# EasyEDA Pro project RFID Arduino REV04.eprj

# Schematic RFID Arduino REV04
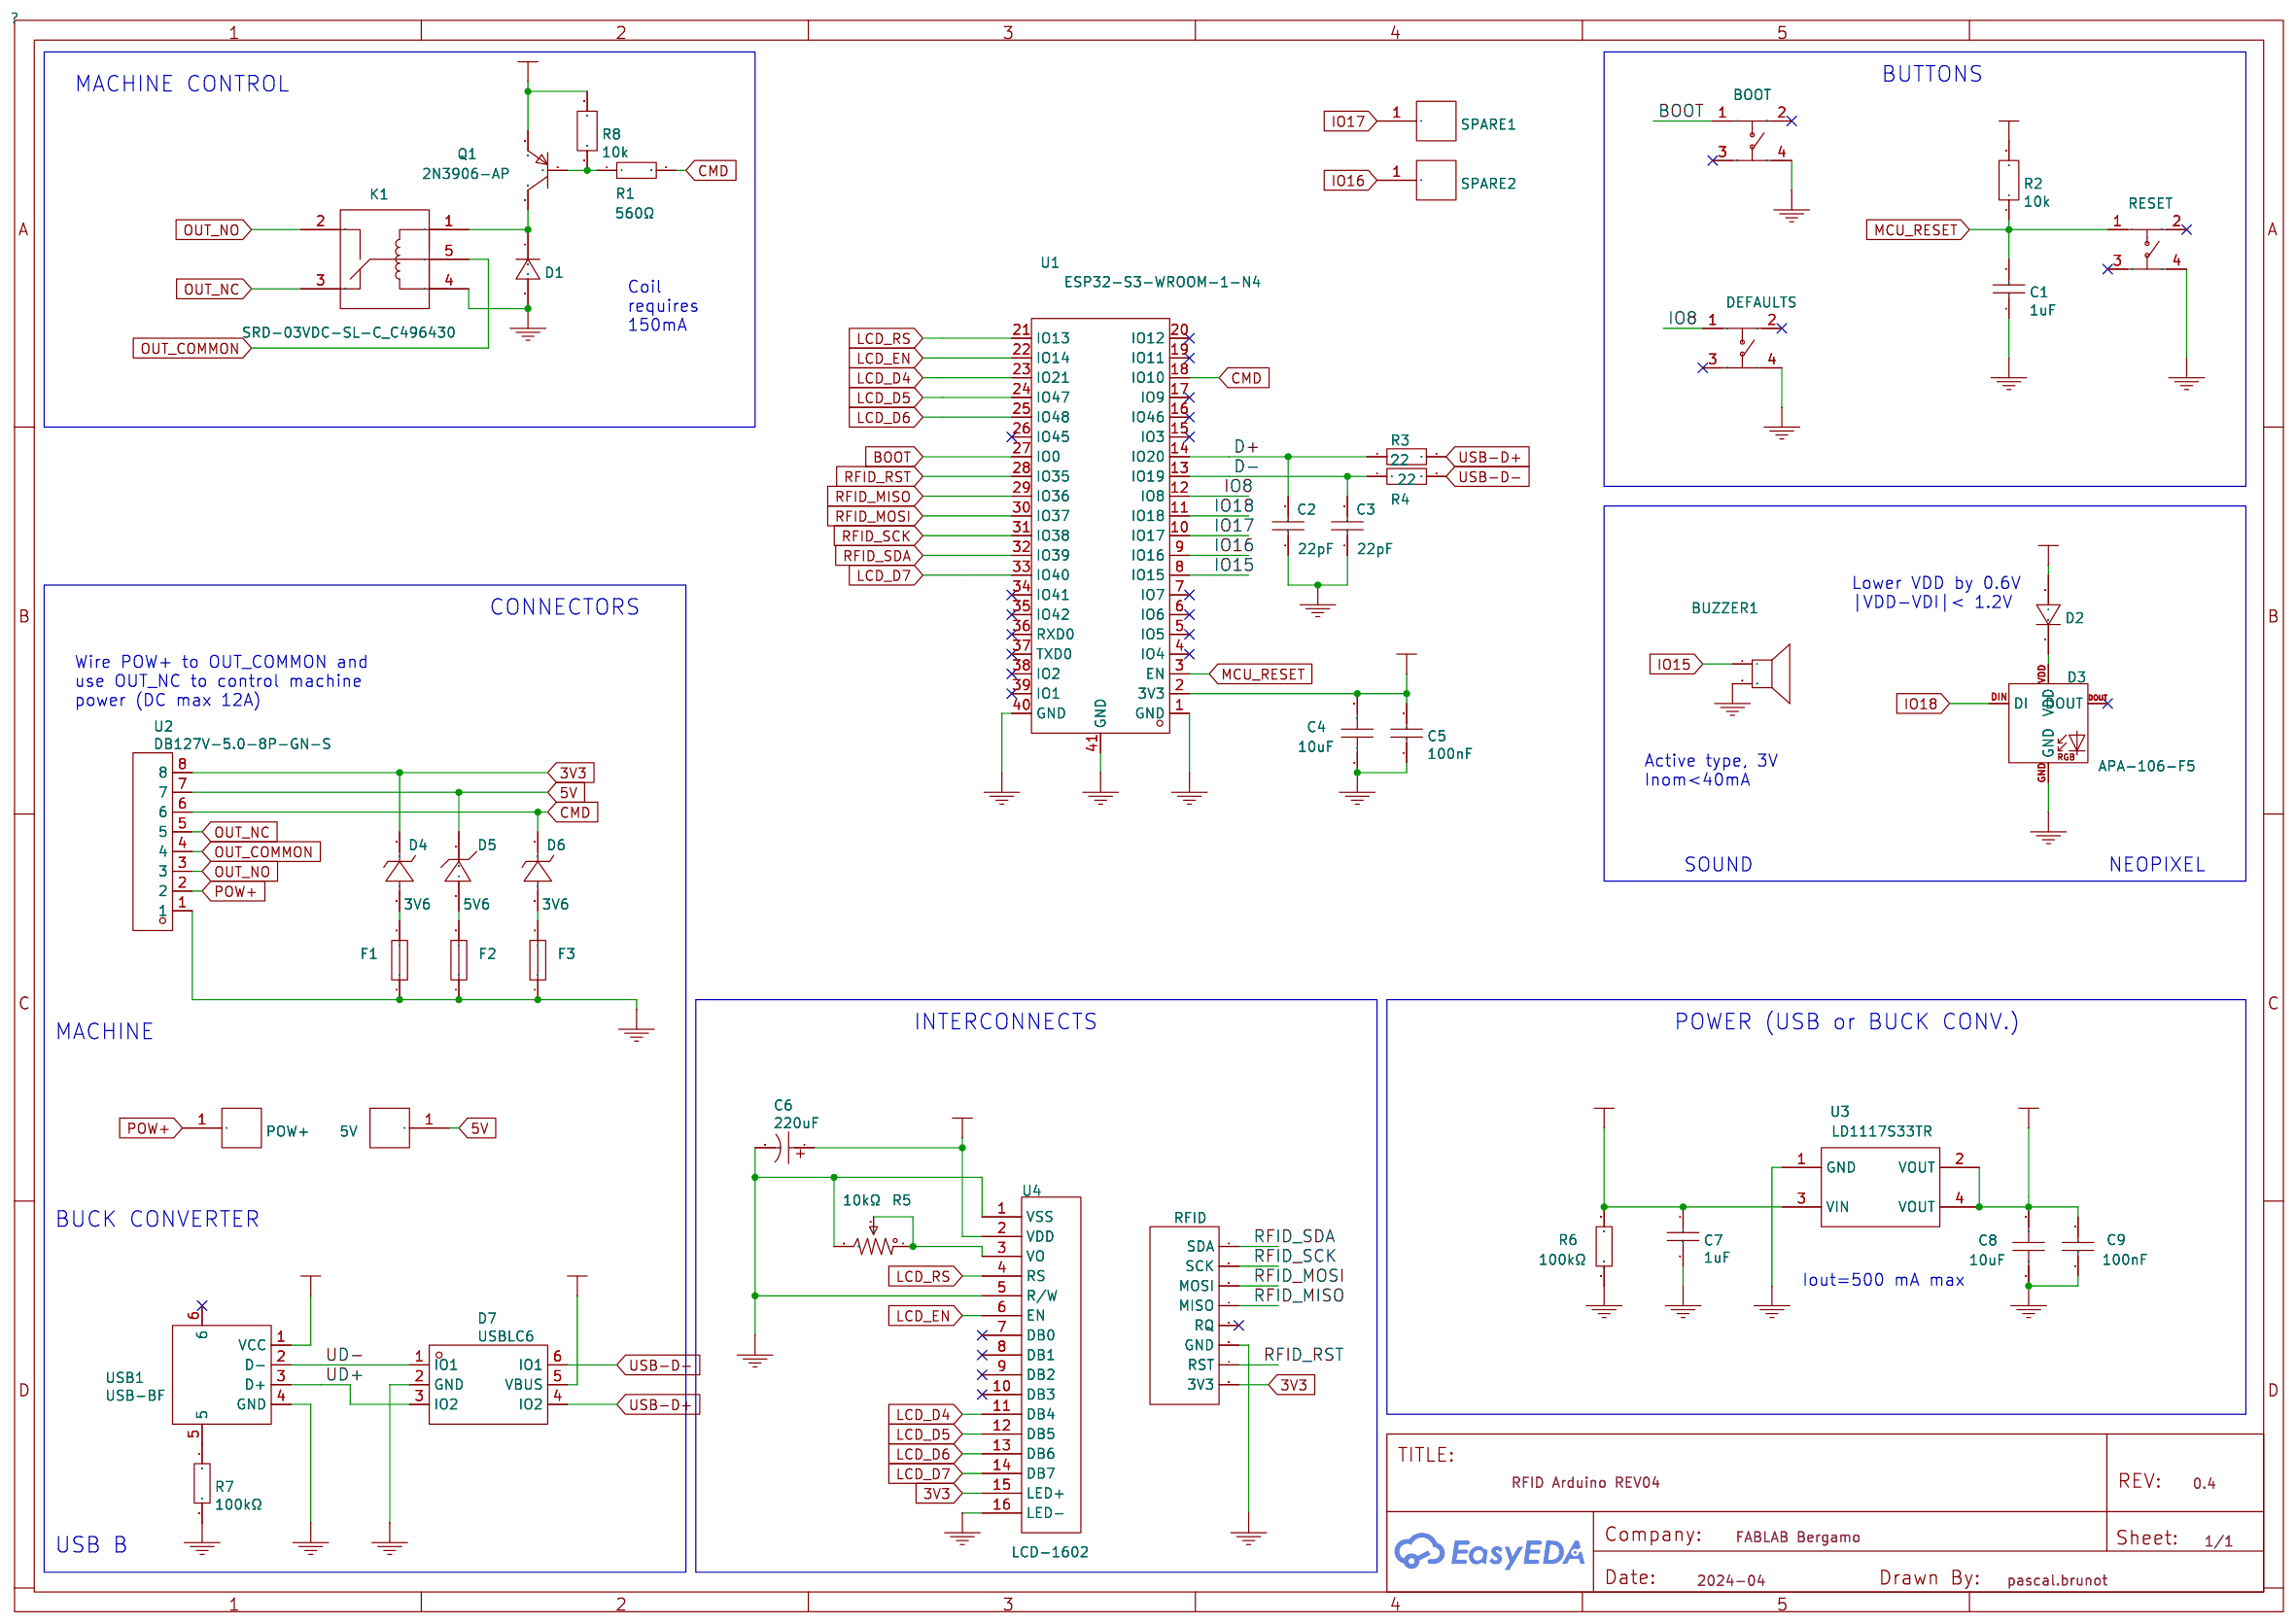
[diagram p0: schematic sheet]

## Parts
5V  0577-0-43-80-21-27-10-0  [footprint_186c]  (no BOM)
BOOT  TS02-66-160-BK-260-LCR-D  [footprint_d5ca]
BUZZER1  4000Hz  [footprint_4700]
C1  1uF  [footprint_c612]
C2  22pF  [footprint_7342]
C3  22pF  [footprint_5873]
C4  10uF  [footprint_c612]
C5  100nF  [footprint_c612]
C6  220uF  [footprint_9de2]
C7  1uF  [footprint_c612]
C8  10uF  [footprint_c612]
C9  100nF  [footprint_c612]
D1  SM4007PL  [footprint_98a7]
D2  SM4007PL  [footprint_98a7]
D3  APA-106-F5  [footprint_7df5]  (no BOM)
D4  3V6  [footprint_9df2]
D5  5V6  [footprint_7d78]
D6  3V6  [footprint_9df2]
D7  USBLC6  [footprint_c63f]
DEFAULTS  TS02-66-160-BK-260-LCR-D  [footprint_01f8]
F1  1206L016WR  [footprint_80a4]
F2  1206L016WR  [footprint_80a4]
F3  1206L016WR  [footprint_80a4]
K1  SRD-03VDC-SL-C_C496430  [footprint_073f]  (no BOM)
P1  RFID  [footprint_407f]
POW+  0577-0-43-80-21-27-10-0  [footprint_186c]  (no BOM)
Q1  2N3906-AP  [footprint_6217]
R1  560Ω  [footprint_ec5b]
R2  10k  [footprint_7623]
R3  22  [footprint_7623]
R4  22  [footprint_7623]
R5  10kΩ  [footprint_ac57]
R6  100kΩ  [footprint_ec5b]
R7  100kΩ  [footprint_ec5b]
R8  10k  [footprint_7623]
RESET  TS02-66-160-BK-260-LCR-D  [footprint_d5ca]
SPARE1  0577-0-43-80-21-27-10-0  [footprint_186c]  (no BOM)
SPARE2  0577-0-43-80-21-27-10-0  [footprint_186c]  (no BOM)
U1  ESP32-S3-WROOM-1-N4  [footprint_15fb]
U2  DB127V-5.0-8P-GN-S  [footprint_3f91]
U3  LD1117S33TR  [footprint_bf77]
U4  LCD-1602  [footprint_ddb7]
USB1  USB-BF  [footprint_8114]

## Library data of the parts
5V POW+ SPARE1 SPARE2 = 0577-0-43-80-21-27-10-0: Supplier: LCSC; Supplier Part: C2895400; Manufacturer: null; JLCPCB Part Class: Extended Part
BOOT DEFAULTS RESET = TS02-66-160-BK-260-LCR-D: Supplier: LCSC; Supplier Part: C4364276; Manufacturer: CUI; JLCPCB Part Class: Extended Part
BUZZER1 = 4000Hz: Supplier: LCSC; Supplier Part: C360607; Manufacturer: S&amp;S(海旭); Manufacturer Part: SFN-12055PA6.5; JLCPCB Part Class: Extended Part
C1 C7 = 1uF: Supplier: LCSC; Manufacturer Part: CL21B105KBFNNNE; Manufacturer: SAMSUNG(三星); Supplier Part: C28323; JLCPCB Part Class: Basic Part
C2 C3 = 22pF: Supplier: LCSC; Manufacturer: FH(风华); Manufacturer Part: 0402CG220J500NT; Supplier Part: C1555; JLCPCB Part Class: Basic Part
C4 C8 = 10uF: Supplier: LCSC; Supplier Part: C440198; Manufacturer: muRata(村田); Manufacturer Part: GRM21BR61H106KE43L; JLCPCB Part Class: Basic Part
C5 C9 = 100nF: Supplier: LCSC; Manufacturer Part: CL21B104KCFNNNE; Manufacturer: SAMSUNG(三星); Supplier Part: C28233; JLCPCB Part Class: Basic Part
C6 = 220uF: Supplier: LCSC; Manufacturer: null; Manufacturer Part: 220uF 10V 5*7; Supplier Part: C43320; JLCPCB Part Class: Extended Part
D1 D2 = SM4007PL: Supplier: LCSC; Manufacturer: MDD; Supplier Part: C64898; JLCPCB Part Class: Basic Part
D3 = APA-106-F5
D4 D6 = 3V6: Supplier: LCSC; Supplier Part: C713621; Manufacturer: LGE(鲁光); Manufacturer Part: 1SMA5914A; JLCPCB Part Class: Extended Part
D5 = 5V6: Supplier: LCSC; Manufacturer Part: ZMM5V6-M; Manufacturer: ST(先科); Supplier Part: C8062; JLCPCB Part Class: Extended Part
D7 = USBLC6: Supplier: LCSC; Supplier Part: C2827654; Manufacturer: TECH PUBLIC(台舟); Manufacturer Part: USBLC6-2SC6; JLCPCB Part Class: Extended Part
F1-F3 = 1206L016WR: Supplier: LCSC; Supplier Part: C151161; Manufacturer: Littelfuse(美国力特); JLCPCB Part Class: Extended Part
K1 = SRD-03VDC-SL-C_C496430: Supplier: LCSC; Supplier Part: C496430; Manufacturer: 松乐; Manufacturer Part: SRD-03VDC-SL-C; JLCPCB Part Class: Extended Part
P1 = RFID: Supplier Part: C27438; Supplier: LCSC; Manufacturer: BOOMELE; Manufacturer Part: Female headerHDR1X8-2.54
Q1 = 2N3906-AP: Supplier: LCSC; Supplier Part: C2987037; Manufacturer: MCC(美微科); JLCPCB Part Class: Extended Part
R1 = 560Ω: Supplier: LCSC; Manufacturer: UNI-ROYAL(厚声); Manufacturer Part: 0805W8F5600T5E; Supplier Part: C28636; JLCPCB Part Class: Basic Part
R2 R8 = 10k: Supplier Part: C17414; Supplier: LCSC; Manufacturer Part: 0805W8F1002T5E; Manufacturer: UNI-ROYAL(厚声)
R3 R4 = 22: Supplier: LCSC; Manufacturer: UNI-ROYAL(厚声); Manufacturer Part: 0603WAF220JT5E; Supplier Part: C23345; JLCPCB Part Class: Basic Part
R5 = 10kΩ: Resistance: 10K; Supplier: LCSC; Supplier Part: C118954; Manufacturer: BOCHEN(博晨); Manufacturer Part: 3296W-1-103; JLCPCB Part Class: Extended Part
R6 R7 = 100kΩ: Supplier: LCSC; Supplier Part: C149504; Manufacturer: UNI-ROYAL(厚声); Manufacturer Part: 0805W8F1003T5E; JLCPCB Part Class: Basic Part
U1 = ESP32-S3-WROOM-1-N4: Supplier: LCSC; Supplier Part: C2913197; Manufacturer: ESPRESSIF(乐鑫); JLCPCB Part Class: Extended Part
U2 = DB127V-5.0-8P-GN-S: Supplier: LCSC; Supplier Part: C430626; Manufacturer: DORABO(地博电气); JLCPCB Part Class: Extended Part
U3 = LD1117S33TR: Supplier: LCSC; Supplier Part: C86781; Manufacturer: ST(意法半导体); JLCPCB Part Class: Extended Part
U4 = LCD-1602: Manufacturer Part: ?
USB1 = USB-BF: Supplier: LCSC; Supplier Part: C114097; Manufacturer: MOLEX; Manufacturer Part: 670688000; JLCPCB Part Class: Extended Part

## Nets
3V3: C4.2 C5.2 C8.2 C9.2 D4.1(C) P1.8(3V3) Q1.1 R2.2 R8.2 U1.2(3V3) U2.8 U3.2(VOUT) U3.4(VOUT) U4.15(LED+)
5V: 5V.1 C6.1 C7.1 D2.2(A) D5.1(C) D7.5(VBUS) R6.2 U2.7 U3.3(VIN) U4.2(VDD) USB1.1(VCC)
GND: BOOT.4 BUZZER1.2 C1.1 C2.1 C3.1 C4.1 C5.1 C6.2 C7.2 C8.1 C9.1 D1.2(A) D3.GND D7.2(GND) DEFAULTS.4 F1.1 F2.1 F3.1 K1.4 P1.6(GND) R5.3 R6.1 R7.2 RESET.4 U1.1(GND) U1.40(GND) U1.41(GND) U2.1 U3.1(GND) U4.1(VSS) U4.5(R/W) U4.16(LED-) USB1.4(GND)
BOOT: BOOT.1 U1.27(IO0)
CMD: D6.1(C) R1.2 U1.18(IO10) U2.6
D+: C2.2 R3.1 U1.14(IO20)
D-: C3.2 R4.1 U1.13(IO19)
IO8: DEFAULTS.1 U1.12(IO8)
IO15: BUZZER1.1 U1.8(IO15)
IO16: SPARE2.1 U1.9(IO16)
IO17: SPARE1.1 U1.10(IO17)
IO18: D3.DIN(DI) U1.11(IO18)
LCD_D4: U1.23(IO21) U4.11(DB4)
LCD_D5: U1.24(IO47) U4.12(DB5)
LCD_D6: U1.25(IO48) U4.13(DB6)
LCD_D7: U1.33(IO40) U4.14(DB7)
LCD_EN: U1.22(IO14) U4.6(EN)
LCD_RS: U1.21(IO13) U4.4(RS)
MCU_RESET: C1.2 R2.1 RESET.1 U1.3(EN)
OUT_COMMON: K1.5 U2.4
OUT_NC: K1.3 U2.5
OUT_NO: K1.2 U2.3
POW+: POW+.1 U2.2
RFID_MISO: P1.4(MISO) U1.29(IO36)
RFID_MOSI: P1.3(MOSI) U1.30(IO37)
RFID_RST: P1.7(RST) U1.28(IO35)
RFID_SCK: P1.2(SCK) U1.31(IO38)
RFID_SDA: P1.1(SDA) U1.32(IO39)
UD+: D7.3(IO2) USB1.3(D+)
UD-: D7.1(IO1) USB1.2(D-)
USB-D+: D7.4(IO2) R3.2
USB-D-: D7.6(IO1) R4.2
$1N49: R5.1 R5.2 U4.3(VO)
$1N85: D1.1(C) K1.1 Q1.3
$1N86: Q1.2 R1.1 R8.1
$1N90: D2.1(C) D3.VDD
$1N92: D6.2(A) F3.2
$1N93: D4.2(A) F1.2
$1N95: D5.2(A) F2.2
$1N1128: R7.1 USB1.5

Not connected (* = marked no-connect by the designer): BOOT 2* 3*; D3 DOUT*; DEFAULTS 2* 3*; P1 5(RQ)*; RESET 2* 3*; U1 4(IO4)* 5(IO5)* 6(IO6)* 7(IO7)* 15(IO3)* 16(IO46)* 17(IO9)* 19(IO11)* 20(IO12)* 26(IO45)* 34(IO41)* 35(IO42)* 36(RXD0)* 37(TXD0)* 38(IO2)* 39(IO1)*; U4 7(DB0)* 8(DB1)* 9(DB2)* 10(DB3)*; USB1 6*

## Notes on the sheet
- MACHINE CONTROL
- BUTTONS
- Coil
  requires
  150mA
- Lower VDD by 0.6V
  |VDD-VDI|< 1.2V
- CONNECTORS
- Wire POW+ to OUT_COMMON and
  use OUT_NC to control machine
  power (DC max 12A)
- Active type, 3V
  Inom<40mA
- SOUND
- NEOPIXEL
- INTERCONNECTS
- POWER (USB or BUCK CONV.)
- MACHINE
- BUCK CONVERTER
- Iout=500 mA max
- USB B

# Board 1-PCB_PCB REV04
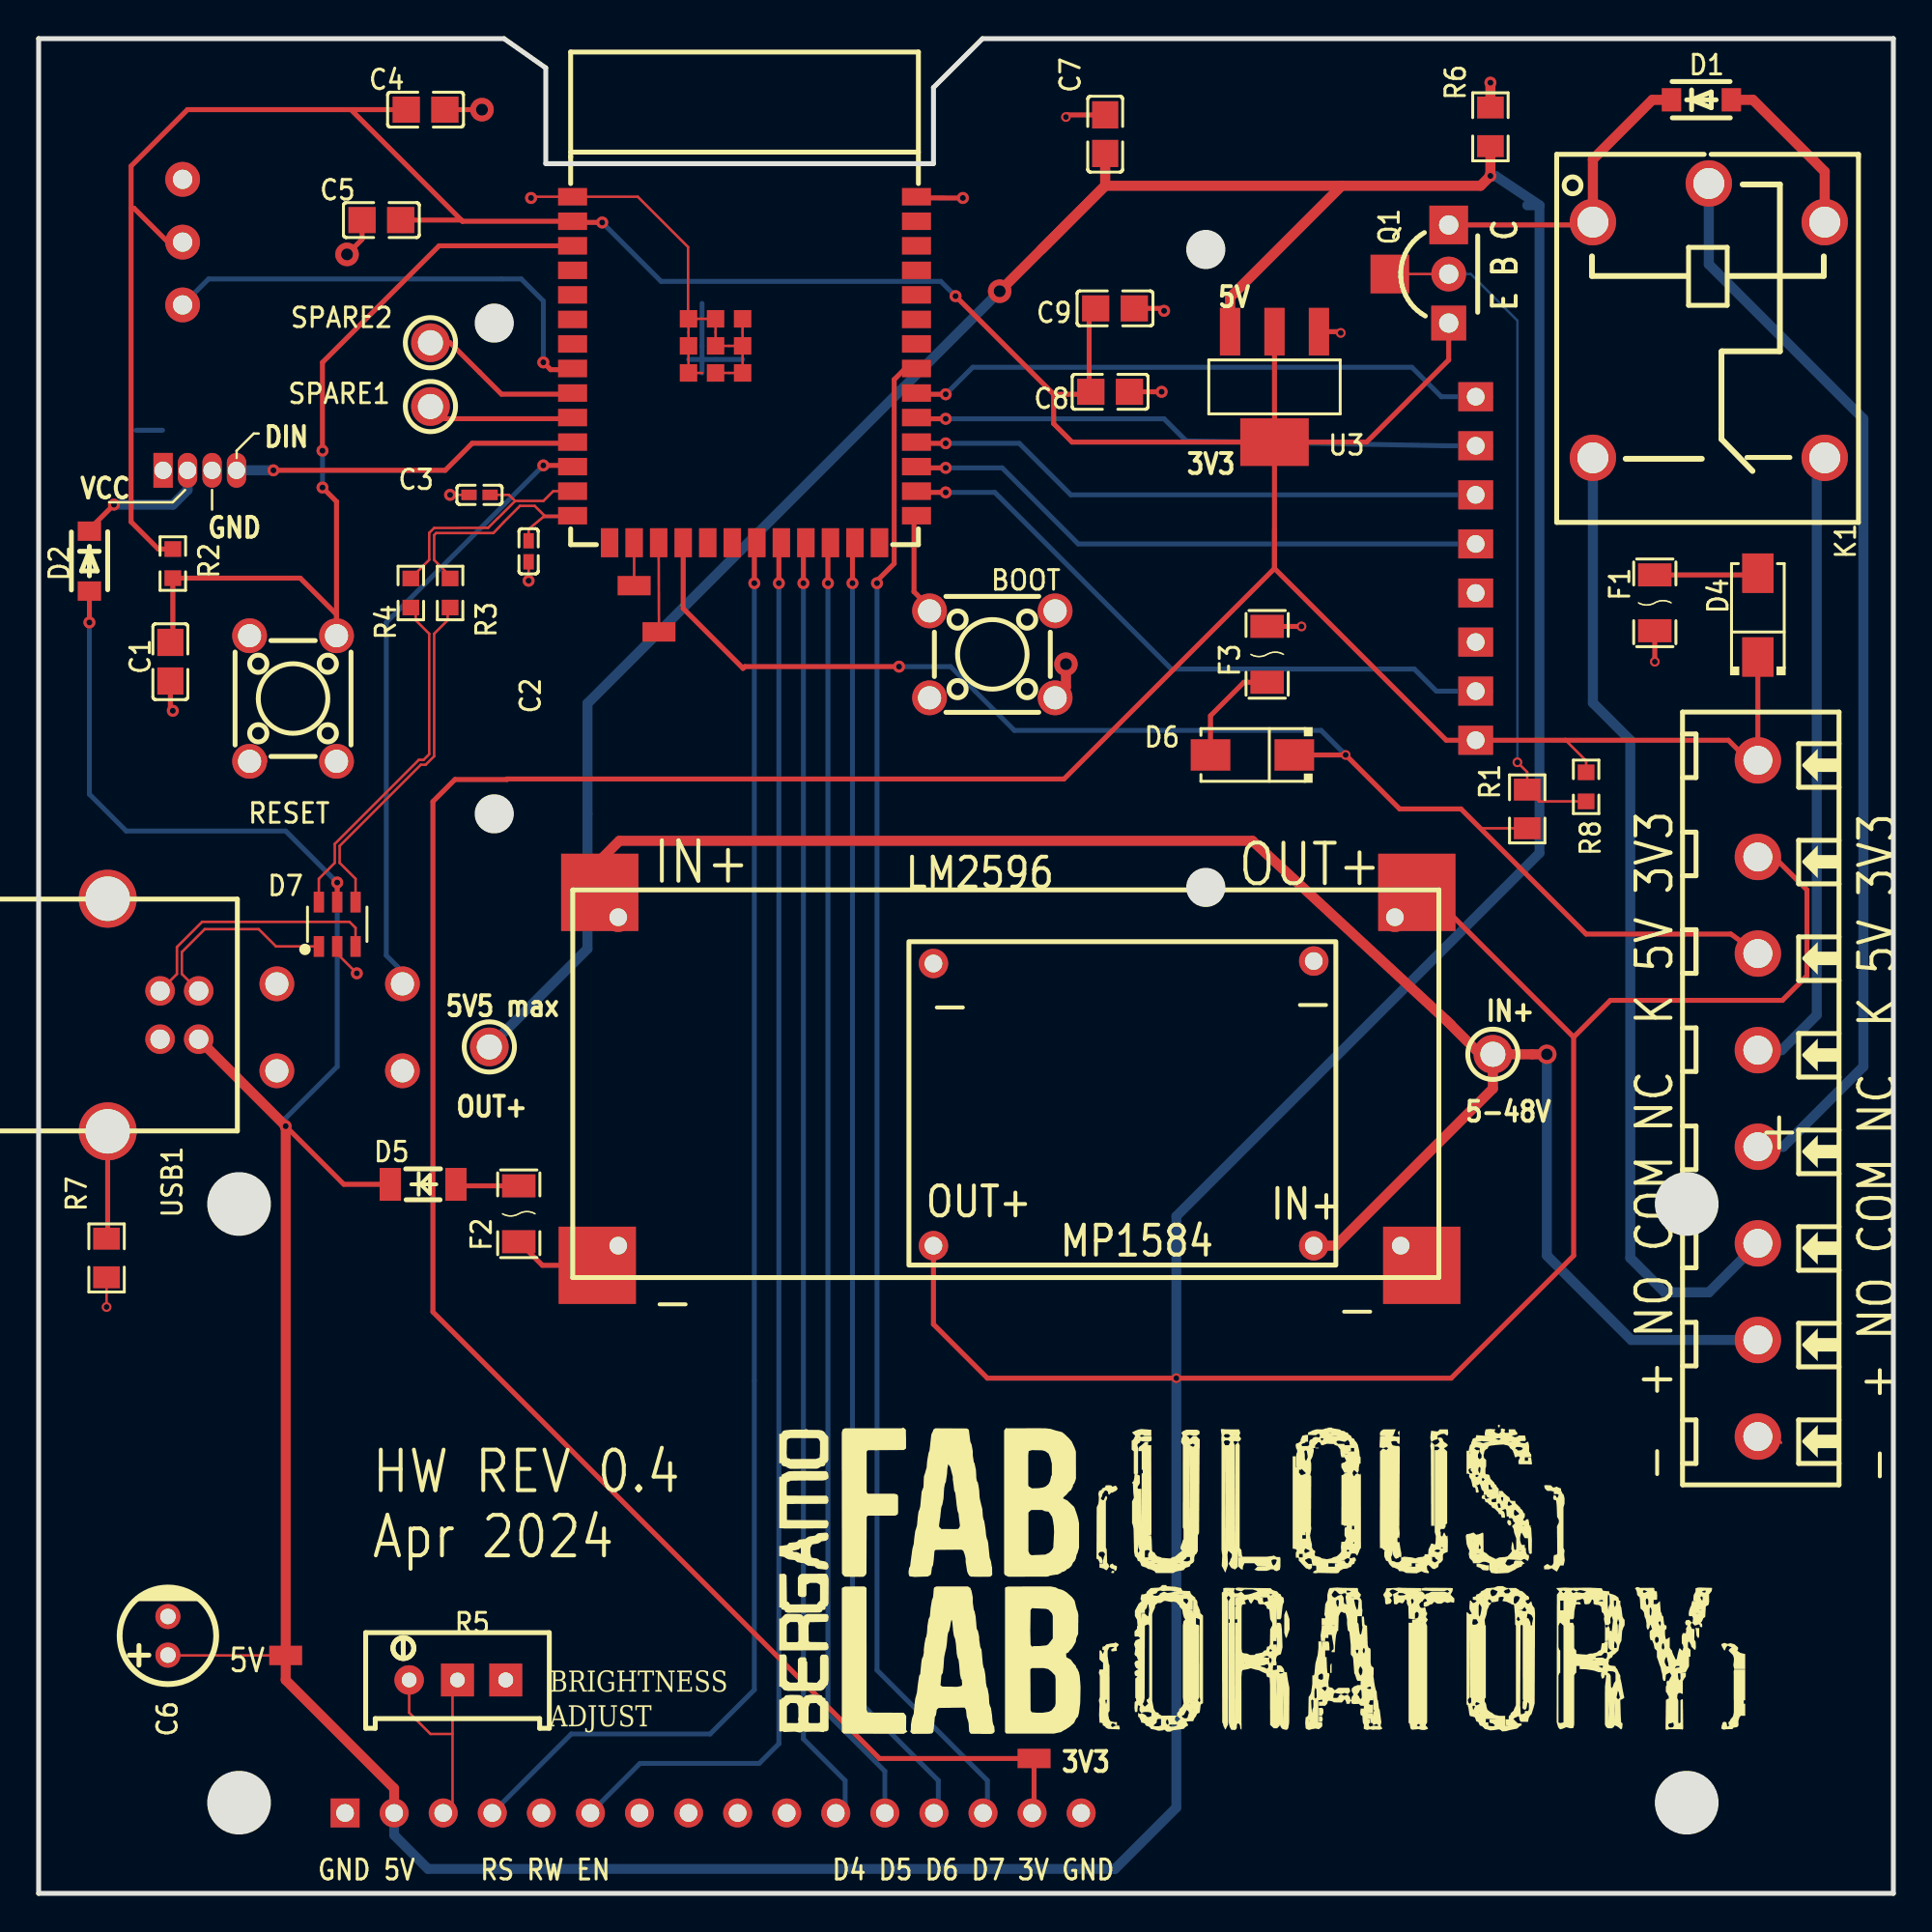
[diagram p1: board, top side]
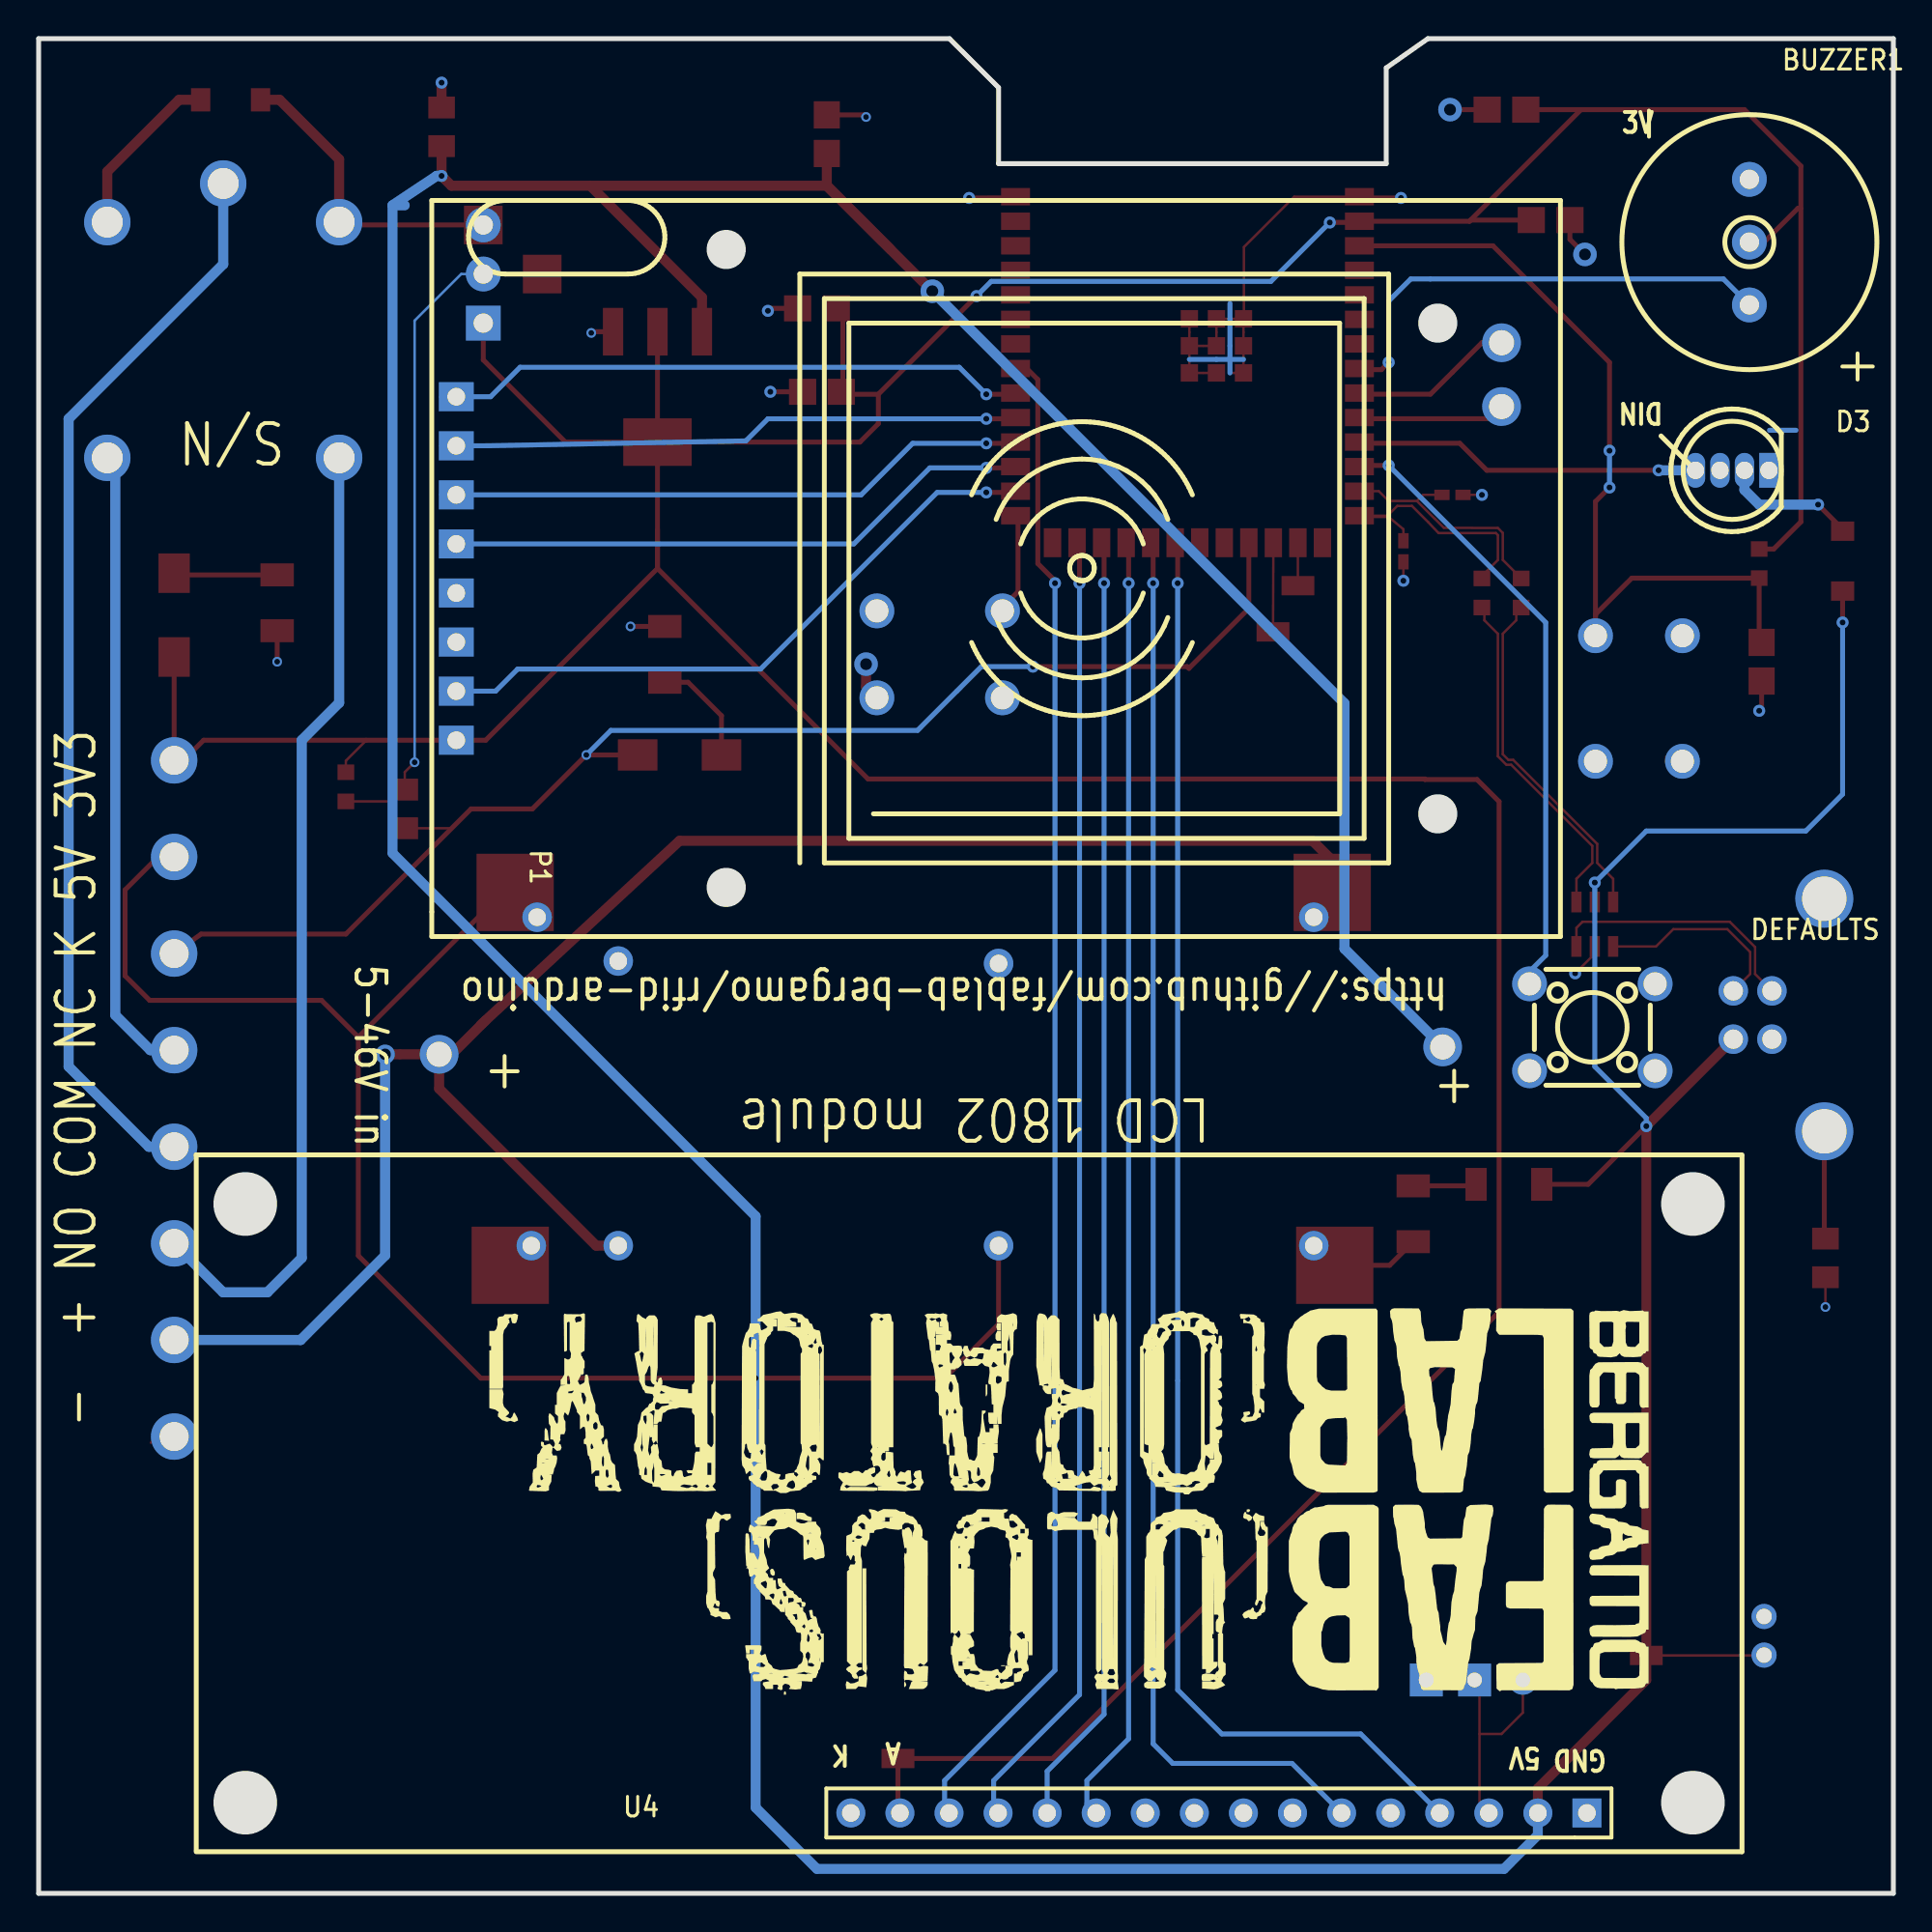
[diagram p2: board, bottom side, seen from below]

Outline 96 x 96 mm; copper layers: Top Layer, Bottom Layer. Coordinates in mm from the lower left corner of the outline.
Outline path: 0,96 24.09,96 26.25,94.48 26.25,89.53 46.31,89.53 46.31,93.47 48.85,96 96,96 96,0 0,0 0,96
Stack: Top Layer 0.035mm / Dielectric1 1.51mm FR4 er 4.5 / Bottom Layer 0.035mm

## Design rules (mm)
template: JLCPCB Capability(Two Layers Board)
spacing copperThickness1oz (default): track to track 0.102, other pairs 0.152 to 0.3
spacing copperThickness2oz: track to track 0.203, other pairs 0.152 to 0.3
track width copperThickness1oz (default): min 0.127, default 0.254, max 2.54
track width copperThickness2oz: min 0.203, default 0.254, max 2.54
differential pair differentialPair (default): width min 0.127, default 0.254, max 2.54; gap min 0.152, default 0.152
via viaSize (default): diameter min 0.5, default 0.61, max 10; hole min 0.3, default 0.305, max 6.3
pour e119 uses gge42753
pour e120 uses gge65606
pour e457 uses gge62858
pour e458 uses gge62867

## Placement (name value [footprint] x y rotation side)
5V  0577-0-43-80-21-27-10-0  [footprint_186c]  23.33 43.81 0 top
BOOT  TS02-66-160-BK-260-LCR-D  [footprint_d5ca]  49.36 64.13 0 top
BUZZER1  4000Hz  [footprint_4700]  7.45 85.47 90 bottom
C1  1uF  [footprint_c612]  6.82 63.75 90 top
C2  22pF  [footprint_7342]  25.36 69.47 90 top
C3  22pF  [footprint_5873]  22.82 72.39 0 top
C4  10uF  [footprint_c612]  20.03 92.33 180 top
C5  100nF  [footprint_c612]  17.74 86.61 0 top
C6  220uF  [footprint_9de2]  6.69 13.33 90 top
C7  1uF  [footprint_c612]  55.21 91.06 90 top
C8  10uF  [footprint_c612]  55.46 77.72 180 top
C9  100nF  [footprint_c612]  55.71 82.04 180 top
D1  SM4007PL  [footprint_98a7]  86.07 92.83 0 top
D2  SM4007PL  [footprint_98a7]  2.63 68.96 270 top
D3  APA-106-F5  [footprint_7df5]  8.34 73.66 180 bottom
D4  3V6  [footprint_9df2]  88.99 66.16 90 top
D5  5V6  [footprint_7d78]  19.9 36.7 0 top
D6  3V6  [footprint_9df2]  62.82 58.92 180 top
D7  USBLC6  [footprint_c63f]  15.45 50.16 0 top
DEFAULTS  TS02-66-160-BK-260-LCR-D  [footprint_01f8]  15.58 44.83 180 bottom
F1  1206L016WR  [footprint_80a4]  83.65 66.8 90 top
F2  1206L016WR  [footprint_80a4]  24.85 35.17 90 top
F3  1206L016WR  [footprint_80a4]  63.59 64.13 270 top
K1  SRD-03VDC-SL-C_C496430  [footprint_073f]  86.45 81.4 270 top
NOREF  -  [Pad_e1095]  46.31 48.13 0 top
NOREF#2  -  [Pad_e459]  30.82 67.69 0 top
NOREF#3  -  [Pad_e461]  69.94 83.82 0 top
NOREF#4  -  [Pad_e1099]  30 50.52 0 top
NOREF#5  -  [Pad_e1100]  70.2 50.52 0 top
NOREF#6  -  [Pad_e1094]  46.31 33.52 0 top
NOREF#7  -  [Pad_e1097]  66 33.52 0 top
NOREF#8  -  [Pad_e454]  28.92 32.51 0 top
NOREF#9  -  [Pad_e453]  29.04 51.81 0 top
NOREF#10  -  [Pad_e460]  32.11 65.29 0 top
NOREF#11  -  [Pad_e452]  12.79 12.31 0 top
NOREF#12  -  [Pad_e1098]  30 33.52 0 top
NOREF#13  -  [Pad_e462]  72.99 86.36 0 top
NOREF#14  -  [Pad_e456]  71.33 51.81 0 top
NOREF#15  -  [Pad_e451]  51.52 6.98 0 top
NOREF#16  -  [Pad_e1101]  70.5 33.52 0 top
NOREF#17  -  [Pad_e455]  71.59 32.51 0 top
NOREF#18  -  [Pad_e1096]  66 48.26 0 top
NOREF#19  -  [Pad_e1120]  24.18 11.04 0 top
NOREF#20  -  [Pad_e1116]  7.45 85.47 0 top
P1  RFID  [footprint_407f]  60.54 62.1 90 bottom
POW+  0577-0-43-80-21-27-10-0  [footprint_186c]  75.27 43.43 0 top
Q1  2N3906-AP  [footprint_6217]  72.99 83.82 90 top
R1  560Ω  [footprint_ec5b]  77.05 56.13 270 top
R2  10k  [footprint_7623]  6.94 68.83 90 top
R3  22  [footprint_7623]  21.3 67.31 270 top
R4  22  [footprint_7623]  19.26 67.31 270 top
R5  10kΩ  [footprint_ac57]  21.68 11.04 0 top
R6  100kΩ  [footprint_ec5b]  75.14 91.44 270 top
R7  100kΩ  [footprint_ec5b]  3.52 32.89 270 top
R8  10k  [footprint_7623]  80.1 57.27 90 top
RESET  TS02-66-160-BK-260-LCR-D  [footprint_d5ca]  13.17 61.84 270 top
SPARE1  0577-0-43-80-21-27-10-0  [footprint_186c]  20.28 76.96 0 top
SPARE2  0577-0-43-80-21-27-10-0  [footprint_186c]  20.28 80.26 0 top
U1  ESP32-S3-WROOM-1-N4  [footprint_15fb]  36.54 78.86 0 top
U2  DB127V-5.0-8P-GN-S  [footprint_3f91]  88.99 41.14 90 top
U3  LD1117S33TR  [footprint_bf77]  63.97 77.97 90 top
U4  LCD-1602  [footprint_ddb7]  38.31 18.16 0 bottom
USB1  USB-BF  [footprint_8114]  5.93 45.46 270 top

## Footprints (pads in the part's own frame, mm; a bottom-side part is the same pattern mirrored in y, then rotated)
footprint_01f8
  round 1.8 hole 1.2: 1(-3.25,2.25) 2(3.25,2.25) 3(-3.25,-2.25) 4(3.25,-2.25)
footprint_3f91
  round 2.4 hole 1.5: 1(-17.5,0) 2(-12.5,0) 3(-7.5,0) 4(-2.5,0) 5(2.5,0) 6(7.5,0) 7(12.5,0) 8(17.5,0)
footprint_7d78
  rect 1.1x1.7 smd: 1(-1.7,0) 2(1.7,0)
footprint_7df5
  oval 1x1.8 hole 0.9: DIN(-1.9,0) GND(-0.635,0) VDD(0.635,0)
  rect 1x1.8 hole 0.9: DOUT(1.9,0)
footprint_9de2
  round 1.3 hole 0.8: 1(-1,0) 2(1,0)
footprint_9df2
  rect 2.046x1.62 smd: 1(-2.17,0) 2(2.169,0)
footprint_15fb
  rect 1.5x0.9 smd: 1(-8.9,8.954) 2(-8.9,7.684) 3(-8.9,6.415) 4(-8.9,5.144) 5(-8.9,3.874) 6(-8.9,2.604) 7(-8.9,1.335) 8(-8.9,0.065) 9(-8.9,-1.206) 10(-8.9,-2.475) 11(-8.9,-3.745) 12(-8.9,-5.016) 13(-8.9,-6.285) 14(-8.9,-7.556) 27(8.9,-7.556) 28(8.9,-6.285) 29(8.9,-5.016) 30(8.9,-3.745) 31(8.9,-2.475) 32(8.9,-1.206) 33(8.9,0.065) 34(8.9,1.335) 35(8.9,2.604) 36(8.9,3.874) 37(8.9,5.144) 38(8.9,6.415) 39(8.9,7.684) 40(8.9,8.954)
  rect 0.9x1.5 smd: 15(-6.985,-8.954) 16(-5.715,-8.954) 17(-4.445,-8.954) 18(-3.175,-8.954) 19(-1.905,-8.954) 20(-0.635,-8.954) 21(0.635,-8.954) 22(1.905,-8.954) 23(3.175,-8.954) 24(4.445,-8.954) 25(5.715,-8.954) 26(6.985,-8.954)
  rect 0.9x0.9 smd: 41(-1.5,1.235) 42(-2.9,1.235) 43(-0.1,1.235) 44(-0.1,2.635) 45(-1.5,2.635) 46(-2.9,2.635) 47(-2.9,-0.165) 48(-1.5,-0.165) 49(-0.1,-0.165)
footprint_073f
  round 2.4 hole 1.6: 1(-5.1,-6) 2(7.1,-6) 3(7.1,6) 4(-5.1,6) 5(-7.1,0)
footprint_80a4
  rect 1.19x1.728 smd: 1(-1.445,0) 2(1.445,0)
footprint_98a7
  rect 1x1.2 smd: 1(-1.55,0) 2(1.55,0)
footprint_186c
  round 2 hole 1.3: 1(0,0)
footprint_407f
  rect 1.5x1.8 hole 0.914: 1(15.367,13.844) 2(12.827,13.844) 3(10.287,13.844) 4(7.747,13.844) 5(5.207,13.844) 6(2.667,13.844) 7(0.127,13.844) 8(-2.413,13.844)
footprint_4700
  round 1.8 hole 1: 1(-3.25,0) 2(3.25,0)
footprint_5873
  rect 0.79x0.54 smd: 1(-0.545,0) 2(0.545,0)
footprint_6217
  rect 1.8x1.8 hole 1: 1(-2.54,0)
  round 1.8 hole 1: 2(0,0) 3(2.54,0)
footprint_7342
  rect 0.79x0.54 smd: 1(-0.545,0) 2(0.545,0)
footprint_7623
  rect 0.806x0.864 smd: 1(-0.753,0) 2(0.753,0)
footprint_8114
  round 1.524 hole 1: 1(1.25,2.355) 2(-1.25,2.355) 3(-1.25,0.355) 4(1.25,0.355)
  round 3 hole 2.3: 5(6.02,-2.355) 6(-6.02,-2.355)
footprint_ac57
  round 1.524 hole 0.762: 1(-2.5,0) 3(2.5,0)
  rect 1.7x1.7 hole 0.762: 2(0,0)
footprint_bf77
  rect 2.465x1.05 smd: 1(2.857,-2.3) 2(2.857,0) 3(2.857,2.3)
  rect 2.465x3.54 smd: 4(-2.857,0)
footprint_c63f
  rect 0.532x1.072 smd: 1(-0.95,-1.149) 2(0,-1.149) 3(0.95,-1.149) 4(0.95,1.149) 5(0,1.149) 6(-0.95,1.149)
footprint_c612
  rect 1.41x1.35 smd: 1(-1,0) 2(1,0)
footprint_d5ca
  round 1.8 hole 1.2: 1(-3.25,2.25) 2(3.25,2.25) 3(-3.25,-2.25) 4(3.25,-2.25)
footprint_ddb7
  rect 1.498x1.498 hole 0.914: 1(-22.453,13.995)
  round 1.498 hole 0.914: 2(-19.913,13.995) 3(-17.373,13.995) 4(-14.834,13.995) 5(-12.293,13.995) 6(-9.754,13.995) 7(-7.213,13.995) 8(-4.673,13.995) 9(-2.134,13.995) 10(0.406,13.995) 11(2.946,13.995) 12(5.487,13.995) 13(8.027,13.995) 14(10.566,13.995) 15(13.107,13.995) 16(15.646,13.995)
footprint_ec5b
  rect 1.133x1.377 smd: 1(-1,0) 2(1,0)
Pad_e451
  rect 1.7x1 smd: 4(0,0)
Pad_e452
  rect 1.7x1 smd: 7(0,0)
Pad_e453
  rect 4x4 smd: 8(0,0)
Pad_e454
  rect 4x4 smd: 9(0,0)
Pad_e455
  rect 4x4 smd: 10(0,0)
Pad_e456
  rect 4x4 smd: 12(0,0)
Pad_e459
  rect 1.7x1 smd: 6(0,0)
Pad_e460
  rect 1.7x1 smd: 6(0,0)
Pad_e461
  rect 2x2 smd: 25(0,0)
Pad_e462
  rect 2x2 smd: 25(0,0)
Pad_e1094
  round 1.524 hole 0.914: 17(0,0)
Pad_e1095
  round 1.524 hole 0.914: 18(0,0)
Pad_e1096
  round 1.524 hole 0.914: 19(0,0)
Pad_e1097
  round 1.524 hole 0.914: 20(0,0)
Pad_e1098
  round 1.524 hole 0.914: 21(0,0)
Pad_e1099
  round 1.524 hole 0.914: 22(0,0)
Pad_e1100
  round 1.524 hole 0.914: 22(0,0)
Pad_e1101
  round 1.524 hole 0.914: 22(0,0)
Pad_e1116
  round 1.8 hole 1: 23(0,0)
Pad_e1120
  rect 1.7x1.7 hole 0.762: 27(0,0)

## Nets
As in the schematic, except:
3V3: C4.2 C5.2 C8.2 C9.2 D4.1 NOREF#15.4 NOREF#20.23 P1.8 Q1.1 R2.2 R8.2 U1.2 U2.8 U3.2 U3.4 U4.15
5V: 5V.1 C6.1 C7.1 D2.2 D5.1 D7.5 NOREF#5.22 NOREF#6.17 NOREF#11.7 NOREF#14.12 R6.2 U2.7 U3.3 U4.2 USB1.1
GND: BOOT.4 BUZZER1.2 C1.1 C2.1 C3.1 C4.1 C5.1 C6.2 C7.2 C8.1 C9.1 D1.2 D3.GND D7.2 DEFAULTS.4 F1.1 F2.1 F3.1 K1.4 NOREF.18 NOREF#8.9 NOREF#12.21 NOREF#16.22 NOREF#17.10 NOREF#18.19 NOREF#19.27 P1.6 R5.3 R6.1 R7.2 RESET.4 U1.1 U1.40 U1.41 U1.42 U1.43 U1.44 U1.45 U1.46 U1.47 U1.48 U1.49 U2.1 U3.1 U4.1 U4.5 U4.16 USB1.4
POW+: NOREF#4.22 NOREF#7.20 NOREF#9.8 POW+.1 U2.2
$1N85: D1.1 K1.1 NOREF#13.25 Q1.3
$1N86: NOREF#3.25 Q1.2 R1.1 R8.1

Pads without a net: BOOT 2 3; D3 DOUT; DEFAULTS 2 3; NOREF#2 6; NOREF#10 6; P1 5; RESET 2 3; U1 4 5 6 7 15 16 17 19 20 26 34 35 36 37 38 39; U4 7 8 9 10; USB1 6

## Via types
v1: diameter 1, hole 0.6, Top Layer to Bottom Layer, 1 via
v2: diameter 0.62, hole 0.31, Top Layer to Bottom Layer, 33 vias
v3: diameter 0.5, hole 0.3, Top Layer to Bottom Layer, 8 vias
v4: diameter 1.22, hole 0.62, Top Layer to Bottom Layer, 4 vias

## Routing (per net, layer and track width the routed paths; a pad name or vN(x,y) marks a point on that pad's centre or on a via; arc(x,y) is an arc through that point)
3V3: length 287.9
  Top Layer w0.127: R8.2 80.1,58.62 79.03,59.69
  Top Layer w0.254: 4.79,87.22 4.94,87.22 6.69,85.47 7.45,85.47 ; 21.94,86.55 21.88,86.61 C5.2 ; 21.94,86.55 27.64,86.55 ; 21.94,86.55 16.17,92.33 ; 27.66,86.49 29.16,86.49 v2(29.17,86.48) ; C9.2 54.71,81.86 54.37,81.53 54.37,77.59 52.54,77.59 ; 52.54,77.59 52.54,76.07 53.49,75.12 U3.4 ; 52.54,77.59 v2(47.46,82.67) ; U3.4 63.97,68.58 ; U3.4 68.73,75.12 72.99,79.37 Q1.1 ; U3.4 U3.2 ; 63.97,68.58 63.97,70.59 ; 63.97,68.58 72.86,59.69 P1.8 79.03,59.69 87.46,59.69 88.5,58.64 U2.8 D4.1 ; 63.97,68.58 53.07,57.68 24.24,57.68 24.24,57.65 21.55,57.65 20.41,56.51 20.41,30.09 43.52,6.98 NOREF#15.4 51.52,4.26 U4.15 ; C4.2 19.2,92.32 19.32,92.2 ; R2.2 6.19,69.58 4.79,70.99 4.79,89.4 7.71,92.33 19.03,92.33
  Bottom Layer w0.254: v2(47.46,82.67) 46.7,83.44 32.22,83.44 v2(29.17,86.48)
5V: length 414.8
  Top Layer w0.127: C6.1 6.71,12.31 NOREF#11.7
  Top Layer w0.254: D7.5 v2(15.45,52.32) ; 79.45,44.32 79.45,33.01 73.11,26.67 v3(58.89,26.67) 49.11,26.67 46.31,29.46 NOREF#6.17 ; 79.45,44.32 71.91,51.86 ; 79.45,44.32 81.36,46.22 90.26,46.22 91.53,47.49 91.53,51.94 89.82,53.64 U2.7 ; D5.1 15.8,36.7 v2(12.79,39.71) ; D2.2 v2(2.63,65.78)
  Top Layer w0.51: U4.2 18.4,5.43 12.79,11.04 NOREF#11.7 v2(12.79,39.71) USB1.1
  Top Layer w0.52: R6.2 v2(75.14,88.9) 74.64,88.39 55.21,88.39 51.9,85.09
  Top Layer w0.521: 55.21,90.05 55.21,88.39 v4(49.74,82.93) ; U3.3 61.67,82.61 67.45,88.39
  Bottom Layer w0.254: v2(2.63,65.78) 2.63,56.89 4.53,54.99 12.79,54.99 v2(15.45,52.32) 15.45,42.8 12.79,40.13 12.79,39.71
  Bottom Layer w0.51: 77.05,87.37 77.68,87.37 77.68,53.84 58.89,35.05 v3(58.89,26.67) 58.89,4.44 55.71,1.27 20.15,1.27 18.4,3.02 U4.2
  Bottom Layer w0.52: v2(75.14,88.9) 75.4,88.9 77.68,87.37 ; v4(49.74,82.93) 32.11,65.29 28.41,61.59 28.41,48.89 5V.1
GND: length 77.4
  Top Layer w0.127: 36.44,81.5 36.44,80.1 ; U1.46 33.62,81.52 33.62,85.21 31.01,87.82 U1.1 25.55,87.82 v2(25.49,87.75) ; U1.46 U1.45 U1.41 36.44,80.1 ; U1.46 U1.42 U1.47 34.34,78.7 ; U1.48 U1.49 U1.43 ; R7.2 v3(3.52,30.35) ; 90.19,23.32 89.87,23.64 U2.1 ; D7.2 15.45,48.64 v2(16.47,47.62) ; v2(21.3,72.39) 22.28,72.39 ; C2.1 v2(25.36,67.94)
  Top Layer w0.254: C1.1 6.82,61.34 v2(6.95,61.21) ; v3(53.17,91.94) 53.28,92.05 55.21,92.05 ; C9.1 58.13,82.04 v2(58.25,81.91) ; 83.65,65.35 v3(83.65,63.75) ; 45.16,87.76 v2(47.84,87.75) ; RESET.4 11.7,58.59 11.7,58.8 ; F3.1 v3(65.37,65.58) ; F2.1 26.07,32.51 NOREF#8.9 ; U3.1 67.33,80.83 v3(67.4,80.77) ; v4(15.96,84.83) 16.74,85.61 C5.1 ; v2(58.13,77.72) C8.1 ; 20.92,92.33 23.01,92.33
  Top Layer w0.52: BOOT.4 53.17,62.44 v4(53.17,63.62) ; D1.2 88.73,92.83 92.45,89.12 K1.4 ; 27.59,31.86 28.95,33.22 ; R6.1 v2(75.14,93.72) ; 35.03,78.64 35,78.64
  Bottom Layer w0.254: 34.34,79.4 34.34,82.29 ; 34.34,79.4 33.64,79.4 ; 34.34,79.4 34.34,78.7 ; 34.34,79.4 36.44,79.4 ; 6.41,75.73 5.04,75.73
  vias: v4(22.95,92.32)
(no net): length 6.8
  Top Layer w0.127: 32.09,69.91 32.11,65.29 ; 30.82,69.91 NOREF#2.6
BOOT: length 5
  Top Layer w0.254: 45.29,71.25 45.29,71.12 45.31,71.14 45.31,71.31 45.31,67.37 45.81,66.87
CMD: length 72.2
  Top Layer w0.127: 74.14,55.64 74.65,55.13 R1.2
  Top Layer w0.254: D6.1 v3(67.65,58.92) 70.44,56.13 73.62,56.13 80.1,49.65 87.59,49.65 U2.6 ; 33.36,69.91 33.36,66.51 36.46,63.41 36.55,63.5 v2(44.54,63.5)
  Bottom Layer w0.254: v2(44.54,63.5) 47.2,63.5 50.51,60.19 66.38,60.19 v3(67.65,58.92)
D+: length 13.2
  Top Layer w0.127: C2.2 25.36,70.61 26.12,71.24 27.14,71.24 ; 21.17,68.06 21.17,68.31 20.47,69.01 20.47,70.3 20.57,70.41 23.54,70.41 24.09,70.99 24.92,71.81 25.68,71.81 26.19,71.31 27.64,71.31
D-: length 12.3
  Top Layer w0.127: 27.64,72.58 26.63,72.58 26.12,72.07 24.66,72.07 23.75,71.15 ; 23.75,71.16 23.26,70.68 20.47,70.67 20.22,70.42 20.22,69.02 19.52,68.32 19.52,68.07 ; 24.6,72.13 24.34,72.39 C3.2
IO8: length 31.5
  Top Layer w0.254: 27.66,73.79 27.54,73.91 v2(26.12,73.91)
  Bottom Layer w0.254: v2(26.12,73.91) 17.99,65.78 17.99,48.55 18.83,47.71
IO15: length 24.6
  Top Layer w0.254: v2(26.12,79.24) 26.5,78.87 27.66,78.87
  Bottom Layer w0.254: 7.45,82.22 8.8,83.56 24.98,83.56 26.12,82.42 v2(26.12,79.24)
IO16: length 8.5
  Top Layer w0.254: SPARE2.1 21.3,80.26 23.96,77.6 27.66,77.6
IO17: length 7.6
  Top Layer w0.254: 27.66,76.33 20.91,76.33 SPARE1.1
IO18: length 18
  Top Layer w0.254: v2(12.15,73.66) 21.04,73.66 22.44,75.06 27.66,75.06
  Bottom Layer w0.52: v2(12.15,73.66) D3.DIN
LCD_D4: length 66.9
  Top Layer w0.254: 39.58,69.97 v2(39.58,67.81)
  Bottom Layer w0.254: U4.11 41.74,4.64 41.74,5.84 39.58,8 v2(39.58,67.81)
LCD_D5: length 67.5
  Top Layer w0.254: 40.85,69.97 v2(40.85,67.81)
  Bottom Layer w0.254: 44.18,3.91 44.05,3.91 U4.12 43.8,6.32 40.85,9.27 v2(40.85,67.81)
LCD_D6: length 67.9
  Top Layer w0.254: 42.12,69.97 42.12,67.69
  Bottom Layer w0.254: U4.13 46.57,4.39 46.57,5.84 42.12,10.28 v2(42.12,67.81)
LCD_D7: length 78.4
  Top Layer w0.254: v2(43.39,67.81) 43.39,67.94 44.28,68.83 44.28,78.36 44.86,78.93 U1.33
  Bottom Layer w0.254: v2(43.39,67.81) 43.39,11.55 49.11,5.84 49.11,4.39 U4.14
LCD_EN: length 73.5
  Top Layer w0.254: 38.31,69.97 v2(38.31,67.81)
  Bottom Layer w0.254: U4.6 31.13,6.73 37.3,6.73 38.31,7.74 v2(38.31,67.81)
LCD_RS: length 75.6
  Top Layer w0.254: 37.04,69.97 v2(37.04,67.81)
  Bottom Layer w0.254: U4.4 27.57,8.25 34.76,8.25 37.04,10.54 v2(37.04,67.81)
MCU_RESET: length 42.9
  Top Layer w0.254: v2(14.69,72.77) 15.42,72.04 RESET.1 15.42,66.2 13.54,68.08 R2.1 ; v2(14.69,74.67) 14.69,79.24 20.72,85.28 27.64,85.28 ; 6.95,68.08 6.95,65.47
  Bottom Layer w0.254: v2(14.69,74.67) v2(14.69,72.77)
OUT_COMMON: length 56.2
  Bottom Layer w0.52: U2.4 90.3,38.64 94.45,42.8 94.45,76.32 86.45,84.32 86.45,88.5
OUT_NC: length 33.1
  Bottom Layer w0.52: K1.3 92.03,74.3 92.03,45.46 90.22,43.64 U2.5
OUT_NO: length 50.6
  Bottom Layer w0.52: K1.2 80.45,61.62 82.38,59.69 82.38,32.89 84.16,31.11 86.45,31.11 U2.3
POW+: length 93.4
  Top Layer w0.52: v1(78.06,43.43) POW+.1 ; POW+.1 74.62,43.43 72.86,45.19 ; POW+.1 75.27,41.65 67.14,33.52 NOREF#7.20 ; NOREF#9.8 29.04,53.46 30.06,54.48 62.82,54.48 73.11,44.95
  Bottom Layer w0.52: U2.2 82.44,28.64 78.06,33.02 v1(78.06,43.43)
RFID_MISO: length 31.6
  Top Layer w0.254: v2(46.95,73.78) 45.29,73.78 45.29,73.79 45.16,73.79
  Bottom Layer w0.254: 75.14,69.85 53.81,69.85 49.87,73.78 v2(46.95,73.78)
RFID_MOSI: length 31.1
  Top Layer w0.254: 45.16,75.06 45.29,75.06 45.29,75.05 v2(46.95,75.05)
  Bottom Layer w0.254: v2(46.95,75.05) 50.76,75.05 53.43,72.39 75.14,72.39
RFID_RST: length 34.2
  Top Layer w0.254: 45.16,72.52 45.29,72.52 45.29,72.51 v2(46.95,72.51)
  Bottom Layer w0.254: 75.14,62.23 72.35,62.23 71.21,63.37 58.63,63.37 49.49,72.51 v2(46.95,72.51)
RFID_SCK: length 30.6
  Top Layer w0.254: v2(46.95,76.32) 45.29,76.32 45.29,76.33 45.16,76.33
  Bottom Layer w0.254: 72.86,74.93 72.86,74.93 ; 72.86,74.93 75.14,74.93 ; 72.86,74.93 59.4,75.18 58.25,76.32 v2(46.95,76.32) ; 72.86,74.93 72.73,74.93
RFID_SDA: length 31.2
  Top Layer w0.254: 45.16,77.6 45.29,77.6 45.29,77.59 v2(46.95,77.59)
  Bottom Layer w0.254: 75.14,77.47 72.6,77.47 71.08,78.99 48.35,78.99 v2(46.95,77.59)
UD+: length 13.5
  Top Layer w0.127: USB1.3 7.16,47.58 7.16,48.98 8.46,50.29 16.09,50.29 16.4,49.97 D7.3
UD-: length 10.3
  Top Layer w0.127: D7.1 12.28,49.01 11.39,49.91 8.6,49.91 7.41,48.72 7.41,47.59 USB1.2
USB-D+: length 18
  Top Layer w0.127: D7.4 16.4,52.51 15.58,53.34 15.58,54.22 19.78,58.42 20.03,58.42 20.47,58.86 20.47,65.2 21.17,65.9 21.17,66.55
USB-D-: length 18
  Top Layer w0.127: D7.6 14.5,52.51 15.33,53.34 15.33,54.32 19.68,58.67 19.92,58.67 20.22,58.96 20.22,65.2 19.52,65.9 19.52,66.55
$1N49: length 11.6
  Top Layer w0.127: U4.3 21.42,4.64 21.42,10.79 R5.2 ; 21.42,8.25 20.28,8.25 19.18,9.35 19.18,11.04
$1N85: length 15.6
  Top Layer w0.254: Q1.3 80.02,86.36
  Top Layer w0.52: D1.1 83.53,92.83 80.45,89.75 K1.1
$1N86: length 35.5
  Top Layer w0.127: v3(76.54,58.54) 77.05,58.03 R1.1 77.66,56.52 R8.1 ; Q1.2 NOREF#3.25
  Bottom Layer w0.127: 76.54,58.42 76.54,81.4 74.13,83.82 Q1.2
$1N90: length 7
  Top Layer w0.254: v2(3.9,71.88) 2.63,70.61 D2.1
  Bottom Layer w0.52: v2(3.9,71.88) 6.94,71.88 7.71,72.64 D3.VDD
$1N92: length 5.7
  Top Layer w0.254: D6.2 60.66,60.96 62.39,62.69 F3.2
$1N93: length 5.4
  Top Layer w0.254: F1.2 88.9,68.24 D4.2
$1N95: length 3.3
  Top Layer w0.254: F2.2 21.68,36.62 D5.2
$1N1128: length 5.6
  Top Layer w0.254: USB1.5 3.57,33.95 R7.1

## Copper pours and planes (outline as drawn; the poured copper is in the pictures)
GND on Top Layer: 31.26,32.57 63.48,32.57 64.48,32.64 65.62,32.25 73.62,40.25 73.87,42.41 73.87,43.43 65.11,51.43 33.2,51.48 32.4,50.68 32.4,50.65 31.24,49.49 31.24,32.84
GND on Bottom Layer: 31.96,80.77 37.3,80.77 38.31,79.75 38.31,75.31 37.3,74.29 32.09,74.29 31.33,75.05 31.33,75.43 31.2,75.56 31.2,79.88
GND on Bottom Layer: -0.04,96.26 22.95,96.01 25.36,94.36 26,88.77 46.7,88.52 47.59,93.47 51.52,95.25 92.03,95.5 96.23,93.85 96.99,59.18 96.86,33.02 96.99,26.41 96.99,4.06 93.43,0.5 0.47,0.5 -0.17,1.14 -0.17,1.39 -0.55,1.77

Small or netless copper shapes (teardrops, artwork), in the pictures only: 1 on Top Layer

## Text on the board
Bottom Silkscreen Layer: A | K | DIN | GND | 5V | 3V | 5-46V in | https://github.com/fablab-bergamo/rfid-arduino | -  + NO COM NC K 5V 3V3 | + | - | LCD 1802 module | S/N
Document Layer: REV 0.3 / BUGFIX: LCD RW must be set to GND / BUGFIX: ESP32 cannot supply enough current for Relay, added Q1 / Moved RFID card to the right to avoid overlap with DEFAULTS button / Changed large caps to 0805 footprints / Replaced variable resistor with more common footprint / Added components values / Added Input protections with fuses / Changed tactile switches model to through hole model / USB tracks rerouted to avoid pads breaking the data lines / Add large cap for LCD power / Can't move LCD hole out of the terminal blocks / REV 0.4: / Added pull-up resistor for Q1
Top Solder Mask Layer: GND | VCC
Top Silkscreen Layer: GND | 5V | RS RW EN | D4 D5 D6 D7 3V GND | VCC | DIN | 5V5 max | OUT+ | 3V3 | 5-48V | IN+ | E B C | LM2596 | MP1584 | -  + NO COM NC  K 5V 3V3 | - | + | HW REV 0.4 / Apr 2024 | BRIGHTNESS / ADJUST
